# Altium schematic sheet Schematic.SchDoc
size A2; ENG_APP_DATE: --/--/--; DSN_APP_DATE: --/--/--; CHK_APP_DATE: --/--/--; SheetNumber: 1; SheetTotal: 1
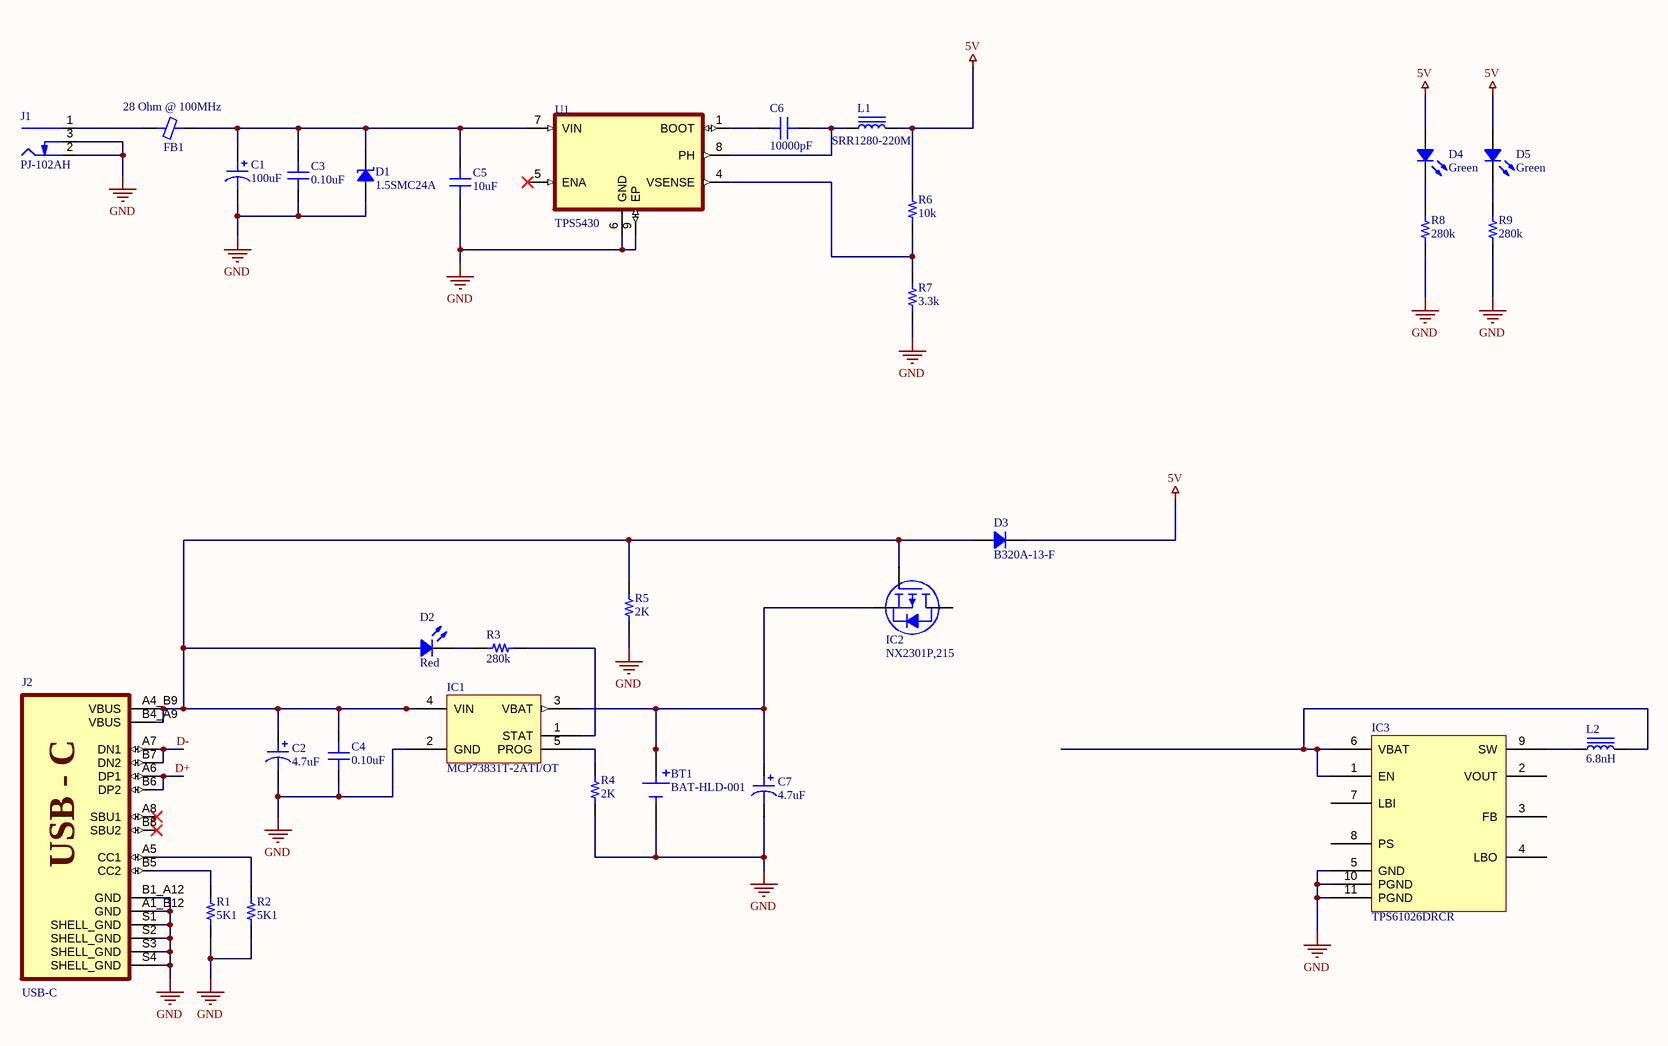
[diagram p0: Schematic.SchDoc]

## Parts
BT1  BAT-HLD-001  [BAT_BAT-HLD-001]
C1  100uF  [CAP ALUM 10.3MM]
C2  4.7uF  [CAP AL TH D10 L5 H14.5]
C3  0.10uF  [CAP 0603/1608]
C4  0.10uF  [CAP 0603/1608]
C5  10uF  [CAP 1210/3225 - 2.8MM]
C6  10000pF  [CAP 0805/2012]
C7  4.7uF  [CAP AL TH D10 L5 H14.5]
D1  1.5SMC24A  [DO214AB SMC]
D2  Red  [LED 0603/1608 RED]
D3  B320A-13-F  [DO214AC SMA]
D4  Green  [LED 0603/1608 GREEN]
D5  Green  [LED 0603/1608 GREEN]
FB1  28 Ohm @ 100MHz  [FER 0603/1608]
IC1  MCP73831T-2ATI/OT  [MICROCHIP SOT-23-5 OT]
IC2  NX2301P,215  [NXP SOT-23-3 TO-236AB]
IC3  TPS61026DRCR  [TI PVSON-10 3x3MM DRC]
J1  PJ-102AH  [CUI PJ-102AH]
J2  USB-C  [GCT_USB4105-GF-A]
L1  SRR1280-220M  [BOURNS SRR1280]
L2  6.8nH  [IND 0402/1005 RF WW]
R1  5K1  [RES 0603/1608]
R2  5K1  [RES 0603/1608]
R3  280k  [RES 1206/3216]
R4  2K  [RES 0603/1608]
R5  2K  [RES 0805/2012]
R6  10k  [RES 0603/1608]
R7  3.3k  [RES 0603/1608]
R8  280k  [RES 1206/3216]
R9  280k  [RES 1206/3216]
U1  TPS5430  [VREG_LM5017MR/NOPB]

## Nets
5V: D3.2 D4.1 D5.1 L1.2 R6.2
GND: BT1.N1(NEG) C1.2 C2.2 C3.1 C4.1 C5.2 C7.2 D1.1 IC1.2(GND) IC3.5(GND) IC3.10(PGND) IC3.11(PGND) J1.2(Outer) J1.3(SW) J2.A1_B12(GND) J2.B1_A12(GND) J2.S1(SHELL_GND) J2.S2(SHELL_GND) J2.S3(SHELL_GND) J2.S4(SHELL_GND) R1.1 R2.1 R4.1 R5.1 R7.1 R8.2 R9.2 U1.6(GND) U1.9(EP)
D+: J2.A6(DP1) J2.B6(DP2)
D-: J2.A7(DN1) J2.B7(DN2)
NetBT1_P1: BT1.P1(POS) BT1.P2(POS) C7.1 IC1.3(VBAT) IC2.3(S)
NetC1_1: C1.1 C3.2 C5.1 D1.2 FB1.2 U1.7(VIN)
NetC2_1: C2.1 C4.2 D2.1 D3.1 IC1.4(VIN) IC2.1(G) J2.A4_B9(VBUS) J2.B4_A9(VBUS) R5.2
NetC6_1: C6.1 U1.1(BOOT)
NetC6_2: C6.2 L1.1 U1.8(PH)
NetD2_2: D2.2 R3.1
NetD4_2: D4.2 R8.1
NetD5_2: D5.2 R9.1
NetFB1_1: FB1.1 J1.1(Centre)
NetIC1_1: IC1.1(STAT) R3.2
NetIC1_5: IC1.5(PROG) R4.2
NetIC3_1: IC3.1(EN) IC3.6(VBAT) L2.2
NetIC3_9: IC3.9(SW) L2.1
NetJ2_A5: J2.A5(CC1) R2.2
NetJ2_B5: J2.B5(CC2) R1.2
NetR6_1: R6.1 R7.2 U1.4(VSENSE)

Not connected (* = marked no-connect by the designer): IC2 2(D); IC3 2(VOUT) 3(FB) 4(LBO) 7(LBI) 8(PS); J2 A8(SBU1)* B8(SBU2)*; U1 5(ENA)*

## Notes on the sheet
- DWG NO:
- REV:
- THIS DOCUMENT AND THE DATA DISCLOSED HEREIN OR
- HEREWITH IS THE PROPERTY OF ALTIUM LIMITED AND MAY
- BE FREELY DISTRIBUTED IN WHOLE. NO RIGHTS ARE
- RESERVED OR EXPRESS OR IMPLIED WARANTEE GIVEN.
- REVISION
- DESCRIPTION
- DATE
- APPROVED
- ENG:
- APPROVALS
- PROJECT
- DSN:
- CHK:
- REFERENCE DOCUMENTS
- PROJECT REVISION:
- TITLE
- DOCUMENT REVISION:
- DESIGN ITEM:
- BOM:
- FAB DWG:
- PCB DWG:
- ASSY DWG:
- SCALE:
- A2
- SIZE
- CAGE CODE
- FILE NAME
- DWG NO.
- SHEET
- OF
- REV
- (in symbol USB4105-GF-A) USB - C

## Library data of the parts
BT1 = BAT-HLD-001: Battery Retainer Coin, 20.0mm 1 Cell SMD (SMT) Tab; Value: *; MP: BAT-HLD-001; Package: None; Availability: Unavailable; Price: None
C1 = EEE-1HA101P: CAP ALUM 100UF 20% 50V SMD; Manufacturer: Panasonic Electronic Components; TemperatureRange: -40C ~ 85C; Type: Automotive; Ripple Current: 250mA; Lifetime @ Temp: 2000 Hrs @ 85C; Value: 100uF; Part Number: EEE-1HA101P; PartId: 7398; Supplier 1: Digi-Key; Supplier Part Number 1: PCE3916TR-ND; ComponentLink1Description: Datasheet; ComponentLink1URL: http://media.digikey.com/pdf/Data%20Sheets/Panasonic%20Electronic%20Components/S_Series_Type_V.pdf; ComponentLink2Description: Digi-Key listing; ComponentLink2URL: http://digikey.com/product-detail/en/EEE-1HA101P/PCE3916TR-ND/766083; Tolerance: 20%; Voltage: 50V; Price: 0.3144; Device Package: Radial, Can - SMD; Impedance: -
C2 C7 = UPM2C4R7MPD1TD: CAP ALUM 4.7UF 20% 160V RADIAL; Manufacturer: Nichicon; TemperatureRange: -40C ~ 105C; Type: Polar; Ripple Current: 57mA @ 120Hz; Value: 4.7uF; Part Number: UPM2C4R7MPD1TD; PartId: 24632; Supplier 1: Digi-Key; Supplier Part Number 1: 493-5313-3-ND; ComponentLink1Description: Datasheet; ComponentLink1URL: http://nichicon-us.com/english/products/pdfs/e-upm.pdf; ComponentLink2Description: Digi-Key Listing; ComponentLink2URL: https://www.digikey.com/product-detail/en/nichicon/UPM2C4R7MPD1TD/493-5313-3-ND/3130318; Tolerance: 20%; Voltage: 160V; Price: 0.2252; Device Package: Radial, Can, 10mm
C3 C4 = C0603C104J3RACTU: CAP CER 0.1UF 25V X7R 0603; Manufacturer: Kemet; TemperatureRange: -55C ~ 125C; Tolerance: 5%; Value: 0.10uF; Part Number: C0603C104J3RACTU; PartId: 13224; Supplier 1: Digi-Key; Supplier Part Number 1: 399-1282-2-ND; ComponentLink1Description: Datasheet; ComponentLink1URL: http://www.kemet.com/docfinder?Partnumber=C0603C104J3RACTU; ComponentLink2Description: Digi-Key Listing; ComponentLink2URL: https://www.digikey.com/product-detail/en/kemet/C0603C104J3RACTU/399-1282-2-ND/416045; TemperatureCoefficient: X7R; Voltage: 25V; Price: 0.0714; Device Package: 0603 (1608 Metric)
C5 = 12105C106KAT2A: CAP CER 10UF 50V X7R 1210; Manufacturer: AVX Corporation; TemperatureRange: -55C ~ 125C; Tolerance: 10%; Value: 10uF; Part Number: 12105C106KAT2A; PartId: 19201; Supplier 1: Digi-Key; Supplier Part Number 1: 478-9912-2-ND; ComponentLink1Description: Datasheet; ComponentLink1URL: http://datasheets.avx.com/X7RDielectric.pdf; ComponentLink2Description: Digi-Key Listing; ComponentLink2URL: https://www.digikey.com/product-detail/en/avx-corporation/12105C106KAT2A/478-9912-2-ND/6006191; TemperatureCoefficient: X7R; Voltage: 50V; Price: 0.2813; Device Package: 1210 (3225 Metric)
C6 = C0805C103K5RACAUTO: CAP CER 10000PF 50V X7R 0805; Manufacturer: Kemet; TemperatureRange: -55C ~ 125C; Tolerance: 10%; Value: 10000pF; Part Number: C0805C103K5RACAUTO; PartId: 14086; Supplier 1: Digi-Key; Supplier Part Number 1: 399-6924-2-ND; ComponentLink1Description: Datasheet; ComponentLink1URL: http://www.kemet.com/docfinder?Partnumber=C0805C103K5RACAUTO; ComponentLink2Description: Digi-Key Listing; ComponentLink2URL: https://www.digikey.com/product-detail/en/kemet/C0805C103K5RACAUTO/399-6924-2-ND/3314918; TemperatureCoefficient: X7R; Voltage: 50V; Price: 0.0167; Device Package: 0805 (2012 Metric)
D1 = 1.5SMC24A: TVS DIODE 20.5V 33.2V DO214AB; Manufacturer: Littelfuse Inc.; Current - Peak Pulse (10/1000µs): 45.8A; Power Line Protection: No; Power - Peak Pulse: 1500W (1.5kW); Type: Zener; Unidirectional Channels: 1; Voltage - Breakdown (Min): 22.8V; Part Number: 1.5SMC24A; Applications: General Purpose; ComponentLink1Description: Datasheet; ComponentLink1URL: https://www.littelfuse.com/~/media/electronics/datasheets/tvs_diodes/littelfuse_tvs_diode_1_5smc_datasheet.pdf.pdf; ComponentLink2Description: DigiKey Link; ComponentLink2URL: http://digikey.com/product-detail/en/littelfuse-inc/1.5SMC24A/1.5SMC24ACT-ND/1835386; LastUpdated: 9/2/2020 1:20:00 AM; Lifecycle Status: Active; Minimum Order: 1; Mounting Type: Surface Mount; Operating Temperature: -55°C ~ 150°C (TJ); Package / Case: DO-214AB, SMC; Packaging: TapeAndReel; PartId: 6399; Part Status: Active; Price: 0.18; Series: 1.5SMC; Supplier 1: DigiKey; Supplier Part Number 1: 1.5SMC24ACT-ND; Supplier Device Package: DO-214AB (SMCJ); Voltage - Clamping (Max) @ Ipp: 33.2V; Voltage - Reverse Standoff (Typ): 20.5V
D2 = LS Q976-NR-1: LED RED DIFFUSED 0603 SMD; Manufacturer: OSRAM Opto Semiconductors Inc.; Value: Green; Type: Surface Mount; Millicandela: 104mcd; Voltage Forward: 2V; Current (Test): 20mA; Viewing Angle: 160; Part Number: LS Q976-NR-1; PartId: 7063; Supplier 1: Digi-Key; Supplier Part Number 1: 475-2512-2-ND; ComponentLink1Description: Datasheet; ComponentLink1URL: http://www.osram-os.com/Graphics/XPic9/00128792_0.pdf; ComponentLink2Description: Digi-Key Listing; ComponentLink2URL: http://www.digikey.ca/product-detail/en/LS%20Q976-NR-1/475-2512-2-ND/1227986; Price: 0.0654; Device Package: 0603 (1608 Metric); Colour: Red; Lens Transparency: Diffused
D3 = B320A-13-F: DIODE SCHOTTKY 20V 3A SMA; Manufacturer: Diodes Incorporated; Current Reverse Leakage @ Vr: 500uA @ 20V; Voltage Forward (Vf): 500mV @ 3A; Part Number: B320A-13-F; PartId: 16342; Supplier 1: Digi-Key; Supplier Part Number 1: B320A-FDITR-ND; ComponentLink1Description: Datasheet; ComponentLink1URL: http://www.diodes.com/_files/datasheets/ds30891.pdf; ComponentLink2Description: Digi-Key Listing; ComponentLink2URL: https://www.digikey.com/product-detail/en/diodes-incorporated/B320A-13-F/B320A-FDITR-ND/717692; Junction Operating Temperature: -55C ~ 150C; Price: 0.1348; Type: Schottky; Device Package: DO-214AC, SMA; Voltage DC Reverse (Vr): 20V; Current Rectified: 3A
D4 D5 = HSMQ-C191: LED GREEN DIFFUSED 0603 SMD; Manufacturer: Avago Technologies US Inc.; Type: Surface Mount; Millicandela: 145mcd; Voltage Forward: 3.4V; Current (Test): 20mA; Viewing Angle: 140; Value: Green; Part Number: HSMQ-C191; PartId: 7059; Supplier 1: Digi-Key; Supplier Part Number 1: 516-1807-2-ND; ComponentLink1Description: Datasheet; ComponentLink1URL: http://www.avagotech.com/docs/AV02-0977EN; ComponentLink2Description: Digi-Key Listing; ComponentLink2URL: http://www.digikey.ca/product-detail/en/HSMQ-C191/516-1807-2-ND/1012398; Price: 0.4769; Device Package: 0603 (1608 Metric); Colour: Green; Lens Transparency: Diffused
FB1 = 742792603: FERRITE CHIP 28 OHM 4.0A 0603; Manufacturer: Wurth Electronics Inc; Type: Differential Mode - Single; DC Resistance: 30 mOhm Max; Current Rating: 4A; Part Number: 742792603; PartId: 6745; Value: 28 Ohm @ 100MHz; Supplier 1: Digi-Key; Supplier Part Number 1: 732-1590-2-ND; ComponentLink1Description: Datasheet; ComponentLink1URL: http://katalog.we-online.de/pbs/datasheet/742792603.pdf; ComponentLink2Description: Digi-Key listing; ComponentLink2URL: http://digikey.com/product-detail/en/742792603/732-1590-2-ND/1638994; Price: 0.1829; Device Package: 0603 (1608 Metric)
IC1 = MCP73831T-2ATI/OT: IC CONTROLLR LI-ION 4.2V SOT23-5; Manufacturer: Microchip Technology; Function: Charge Management; Battery Chemistry: Li-Ion, Li-Pol; Voltage Supply: 3.75 V ~ 6 V; Part Number: MCP73831T-2ATI/OT; PartId: 9704; Supplier 1: Digi-Key; Supplier Part Number 1: MCP73831T-2ATI/OTTR-ND; ComponentLink1Description: Datasheet; ComponentLink1URL: http://www.microchip.com/mymicrochip/filehandler.aspx?ddocname=en026002; ComponentLink2Description: Digi-Key Listing; ComponentLink2URL: http://www.digikey.com/product-detail/en/microchip-technology/MCP73831T-2ATI%2FOT/MCP73831T-2ATI%2FOTTR-ND/964303; Price: 0.42; Device Package: SC-74A, SOT-753; Series: -; Operating Temperature: -40C ~ 85C
IC2 = NX2301P,215: MOSFET P-CH 20V 2A TO-236AB; Manufacturer: NXP Semiconductors; Rds On (Max) at Id, Vgs: 120 mOhm @ 1A, 4.5V; Vgs(th) (Max) at Id: 1.1V @ 250uA; Gate Charge (Qg): 6nC @ 4.5V; Input Capacitance (Ciss) at Vds: 380pF @ 6V; Power - Max: 400mW; Current Continuous Drain: 2A (Ta); Part Number: NX2301P,215; PartId: 8179; Supplier 1: Digi-Key; Supplier Part Number 1: 568-10314-2-ND; ComponentLink1Description: Datasheet; ComponentLink1URL: http://www.nxp.com/documents/data_sheet/NX2301P.pdf; ComponentLink2Description: Digi-Key Listing; ComponentLink2URL: http://www.digikey.com/product-detail/en/NX2301P,215/568-10314-2-ND/2779960; Price: 0.072; Type: MOSFET P-Channel, Metal Oxide; Device Package: TO-236-3, SC-59, SOT-23-3; Drain to Source Voltage (Vdss): 20V; Features: Standard
IC3 = TPS61026DRCR: IC REG BOOST 5V 1.5A SYNC 10SON; Manufacturer: Texas Instruments; Function: Step-Up; Output Configuration: Positive; Output Type: Fixed; Number Of Outputs: 1; Voltage - Input (Max): 5.5V; Current Output: 1.5A (Switch); Frequency - Switching: 600kHz; Part Number: TPS61026DRCR; PartId: 9353; Supplier 1: Digi-Key; Supplier Part Number 1: TPS61026DRCR-ND; ComponentLink1Description: Datasheet; ComponentLink1URL: http://www.ti.com/lit/ds/symlink/tps61020.pdf; ComponentLink2Description: Digi-Key Listing; ComponentLink2URL: https://www.digikey.com/product-detail/en/TPS61026DRCR/TPS61026DRCR-ND/1672116; Device Package: 10-VFDFN Exposed Pad; Price: 0.9562; Series: -; Operating Temperature: -40C ~ 85C (TA)
J1 = PJ-102AH: CONN PWR JACK 2X5.5MM SOLDER; Manufacturer: CUI Devices; Actual Diameter: 0.079" (2.00mm ID), 0.256" (6.50mm OD); Current Rating (Amps): 5A; Gender: Male; Industry Recognized Mating Diameter: 2.00mm ID (0.079"), 5.50mm OD (0.217"); Internal Switch(s): Single Switch, Normally Closed; Material Flammability Rating: UL94 V-0; Mating Length/Depth: 0.354" (9.00mm); Number of Positions/Contacts: 2 Conductors, 3 Contacts; Shielding: Unshielded; Voltage - Rated: 24VDC; Part Number: PJ-102AH; ComponentLink1Description: Datasheet; ComponentLink1URL: https://www.cuidevices.com/product/resource/digikeypdf/pj-102ah.pdf; ComponentLink2Description: DigiKey Link; ComponentLink2URL: //digikey.com/product-detail/en/cui-devices/PJ-102AH/CP-102AH-ND/408448; Connector Type: Jack; LastUpdated: 12/16/2019 7:01:27 PM; Lifecycle Status: 0; Minimum Order: 1; Mounting Type: Through Hole, Right Angle; Packaging: Tray; Part Status: Active; Price: 0.76; Series: -; Supplier 1: DigiKey; Supplier Part Number 1: CP-102AH-ND; Termination: Solder
J2 = USB4105-GF-A: USB-C (USB TYPE-C) USB 2.0 Receptacle Connector 24 (16+8 Dummy) Position Surface Mount, Right Angle; Through Hole; Value: *; Availability: Unavailable; Price: None; Package: None; MP: USB4105-GF-A
L1 = SRR1280-220M: FIXED IND 22UH 4.3A 38.6 MOHM; Manufacturer: Bourns Inc.; Type: Wirewound; Material - Core: Ferrite; Tolerance: 20%; Current - Saturation: 4.1A; Shielding: Shielded; DC Resistance (DCR): 38.6 mOhm Max; Q @ Freq: 20 @ 2.52MHz; Frequency - Self Resonant: 11MHz; Value: 22uH; Part Number: SRR1280-220M; PartId: 15714; Supplier 1: Digi-Key; Supplier Part Number 1: SRR1280-220MTR-ND; ComponentLink1Description: Datasheet; ComponentLink1URL: http://www.bourns.com/docs/Product-Datasheets/SRR1280.pdf; ComponentLink2Description: Digi-Key Listing; ComponentLink2URL: https://www.digikey.com/product-detail/en/bourns-inc/SRR1280-220M/SRR1280-220MTR-ND/1969996; Price: 0.7737; Device Package: Nonstandard; Series: SRR1280; Inductance: 22uH; Current Rating: 4.3A; Operating Temperature: -40C ~ 125C
L2 = LQW15AN6N8G00D: FIXED IND 6.8NH 700MA 90 MOHM; Manufacturer: Murata Electronics North America; TemperatureRange: -55C ~ 125C; Tolerance: 2%; Type: Wirewound; Q at Frequency: 25 @ 250MHz; DC Resistance: 90 mOhm Max; Shielding: Unshielded; Value: 6.8nH; Part Number: LQW15AN6N8G00D; PartId: 6426; Supplier 1: Digi-Key; Supplier Part Number 1: 490-6840-2-ND; ComponentLink1Description: Datasheet; ComponentLink1URL: http://search.murata.co.jp/Ceramy/image/img/PDF/ENG/L0075S0080LQW15A_00.pdf; ComponentLink2Description: Digi-Key listing; ComponentLink2URL: http://digikey.com/product-detail/en/LQW15AN6N8G00D/490-6840-2-ND/2594949; Price: 0.0807; Device Package: 0402 (1005 Metric)
R1 R2 = 0603S8J0512: RES SMD 5K1 OHM 5% 1/8W 0603; Manufacturer: Uniohm; TemperatureRange: -55C ~ 155C; TemperatureCoefficient: 100ppm/C; PowerRating: 0.125W, 1/8W; Value: 5K1; Part Number: 0603S8J0512; Tolerance: 5%; Price: 0.0089; Device Package: 1608 (0603 Metric)
R3 R8 R9 = ERA-8AEB2803V: RES SMD 280K OHM 0.1% 1/4W 1206; Manufacturer: Panasonic Electronic Components; TemperatureRange: -55C ~ 155C; TemperatureCoefficient: 25ppm/C; PowerRating: 0.25W, 1/4W; Value: 280k; Part Number: ERA-8AEB2803V; PartId: 3611; Supplier 1: Digi-Key; Supplier Part Number 1: P280KBCTR-ND; ComponentLink1Description: Datasheet; ComponentLink1URL: http://industrial.panasonic.com/lecs/www-data/pdf/AOA0000/AOA0000CE26.pdf; ComponentLink2Description: Digi-Key listing; ComponentLink2URL: http://digikey.com/product-detail/en/ERA-8AEB2803V/P280KBCTR-ND/3070936; Tolerance: 0.1%; Price: 0.1954; Type: Thin Film; Device Package: 1206 (3216 Metric)
R4 = 0603S8J0202: RES SMD 2K OHM 5% 1/8W 0603; Manufacturer: Uniohm; TemperatureRange: -55C ~ 155C; TemperatureCoefficient: 100ppm/C; PowerRating: 0.125W, 1/8W; Value: 2K; Part Number: 0603S8J0202; Tolerance: 5%; Price: 0.0089; Device Package: 1608 (0603 Metric)
R5 = 0805S8J0202: RES SMD 2K OHM 5% 1/8W 0805; Manufacturer: Uniohm; TemperatureRange: -55C ~ 155C; TemperatureCoefficient: 100ppm/C; PowerRating: 0.125W, 1/8W; Value: 2K; Part Number: 0805S8J0202; Tolerance: 5%; Price: 0.0089; Device Package: 2012 (0805 Metric)
R6 = ERA-3AEB103V: RES SMD 10K OHM 0.1% 1/10W 0603; Manufacturer: Panasonic Electronic Components; TemperatureRange: -55C ~ 155C; TemperatureCoefficient: 25ppm/C; PowerRating: 0.1W, 1/10W; Value: 10k; Part Number: ERA-3AEB103V; PartId: 1432; Supplier 1: Digi-Key; Supplier Part Number 1: P10KDBTR-ND; ComponentLink1Description: Datasheet; ComponentLink1URL: http://industrial.panasonic.com/lecs/www-data/pdf/AOA0000/AOA0000CE26.pdf; ComponentLink2Description: Digi-Key listing; ComponentLink2URL: http://digikey.com/product-detail/en/ERA-3AEB103V/P10KDBTR-ND/1465878; Tolerance: 0.1%; Price: 0.055; Type: Thin Film; Device Package: 0603 (1608 Metric)
R7 = ERA-3APB332V: RES SMD 3.3K OHM 0.1% 1/10W 0603; Manufacturer: Panasonic Electronic Components; TemperatureRange: -55C ~ 155C; TemperatureCoefficient: 15ppm/C; PowerRating: 0.1W, 1/10W; Value: 3.3k; Part Number: ERA-3APB332V; PartId: 1857; Supplier 1: Digi-Key; Supplier Part Number 1: P3.3KAYTR-ND; ComponentLink1Description: Datasheet; ComponentLink1URL: http://industrial.panasonic.com/lecs/www-data/pdf/AOA0000/AOA0000CE26.pdf; ComponentLink2Description: Digi-Key listing; ComponentLink2URL: http://digikey.com/product-detail/en/ERA-3APB332V/P3.3KAYTR-ND/3070646; Tolerance: 0.1%; Price: 0.2873; Type: Thin Film; Device Package: 0603 (1608 Metric)
U1 = TPS5430DDA: CONVERTER 5.5V-36 to 5.5V; MF: Texas Instruments; Availability: Unavailable; Mouser-Purchase-URL: https://snapeda.com/shop?store=Mouser&id=226174; Texas_Instruments-Purchase-URL: https://snapeda.com/shop?store=Texas+Instruments&id=226174; Package: HSOIC-8 Texas Instruments; Price: None; SnapEDA_Link: https://www.snapeda.com/parts/TPS5430DDA/Texas%20Instruments/view-part/226174/?ref=snap; MP: TPS5430DDA; DigiKey-Purchase-URL: https://snapeda.com/shop?store=DigiKey&id=226174; Value: *